# Altium schematic sheet Buck_Converter.SchDoc
size A; SheetNumber: 5; SheetTotal: 5
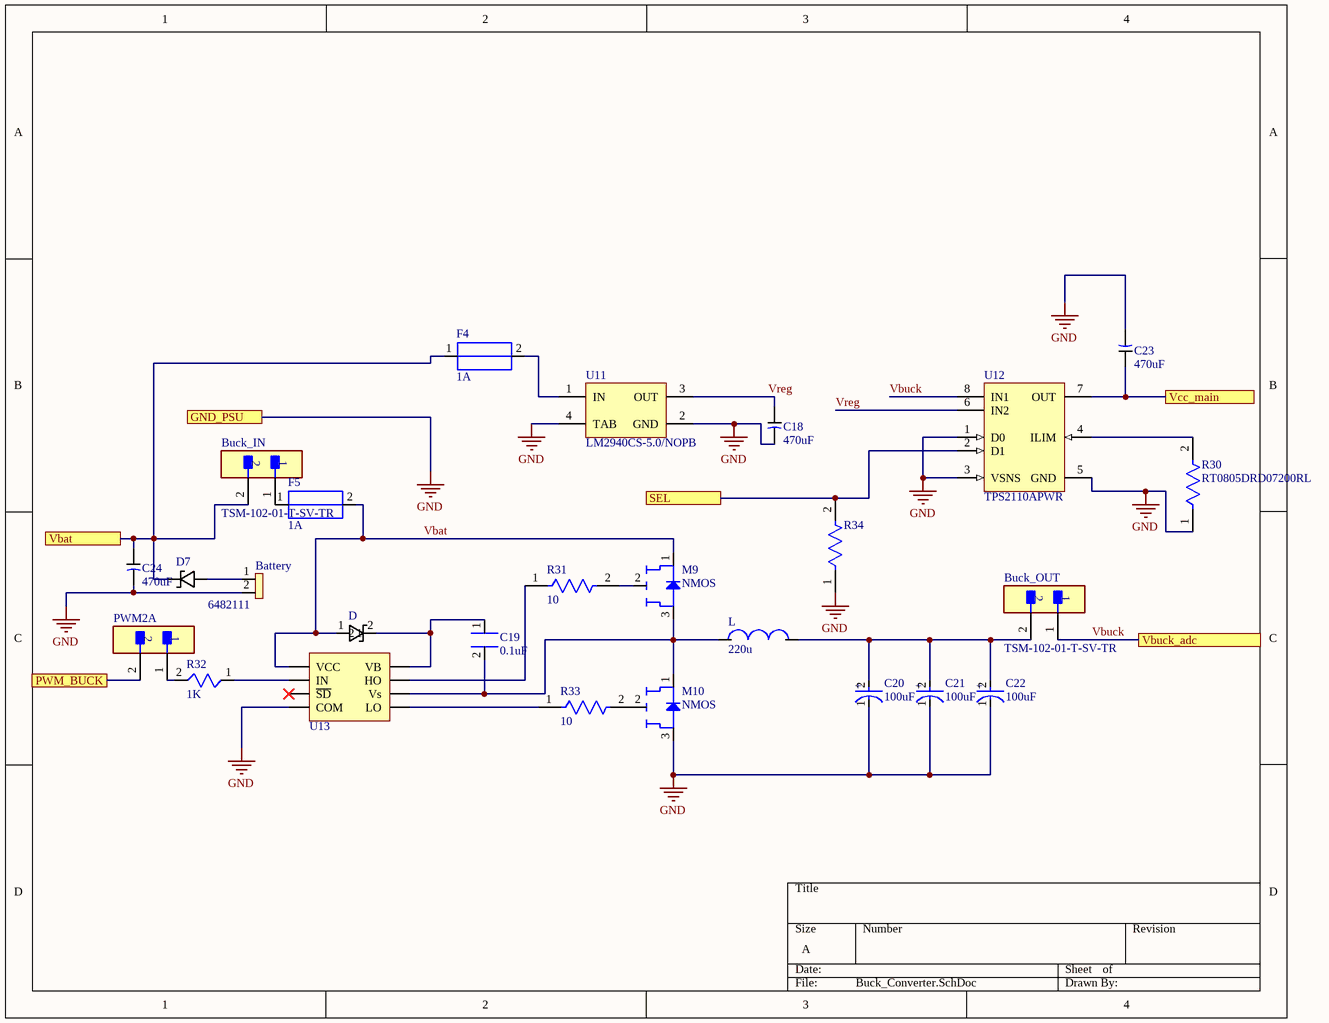
[diagram p0: Buck_Converter.SchDoc]

## Parts
Battery  Supplier Part Number 1: 6482111  [ERM BLOCK 2POS 45DEG 2.5MM PCB]  (hidden comment: Screw Terminal)
Buck_IN  TSM-102-01-T-SV-TR  [FP-TSM-102-01-T-SV-TR-MFG]
Buck_OUT  TSM-102-01-T-SV-TR  [FP-TSM-102-01-T-SV-TR-MFG]
C18  470uF  [ULR477M1AE85RR]
C19  0.1uF  [0805B104K500BD]
C20  100uF  [FP-TAJD-MFG]
C21  100uF  [FP-TAJD-MFG]
C22  100uF  [FP-TAJD-MFG]
C23  470uF  [ULR477M1AE85RR]
C24  470uF  [ULR477M1AE85RR]
D  BAS3005B02VH6327XTSA1  [BAS3005B02VH6327XTSA1]  (value not drawn)
D7  STPS2L25  [STPS2L25]  (value not drawn)
F4  1A  [0ZCG0050AF2C]
F5  1A  [0ZCG0050AF2C]
L  220u  [SRR1280-221K]
M9  NMOS  [AOD424]
M10  NMOS  [AOD424]
PWM2A  TSM-102-01-T-SV-TR  [FP-TSM-102-01-T-SV-TR-MFG]  (value not drawn)
R30  RT0805DRD07200RL  [FP-RT0805-MFG]
R31  10  [FP-RNCP1206-IPC_C]
R32  1K  [RNCP0805FTD10R0]
R33  10  [FP-RNCP1206-IPC_C]
R34  CRCW080510K0FKEA  [FP-CRCW0805-e3-IPC_A]  (value not drawn)
U11  LM2940CS-5.0/NOPB  [KTT0003B_N]
U12  TPS2110APWR  [PW0008A_N]
U13  IR2302  [IR2302S]  (value not drawn)

## Ports
GND_PSU, PWM_BUCK, SEL, Vbat, Vbuck_adc, Vcc_main

## Nets
GND: Battery.2 C18.1 C20.1(C) C21.1(C) C22.1(C) C23.1 C24.1 M10.3(S) R30.1 R34.1 U11.2(GND) U11.4(TAB) U12.1(D0) U12.3(VSNS) U12.5(GND) U13.4(COM) ; port GND_PSU
PWM_BUCK: PWM2A.2 ; port PWM_BUCK
SEL: R34.2 U12.2(D1) ; port SEL
Vbat: D.1 F5.2(-) M9.1(D) U13.1(VCC)
Vbat: Buck_IN.2 C24.2 D7.1 F4.1(+) ; port Vbat  [a separate net that carries the same name]
Vbuck: Buck_OUT.1 U12.8(IN1) ; port Vbuck_adc
Vcc_main: C23.2 U12.7(OUT) ; port Vcc_main
Vreg: C18.2 U11.3(OUT) U12.6(IN2)
NetBattery_1: Battery.1 D7.2
NetBuck_IN_1: Buck_IN.1 F5.1(+)
NetBuck_OUT_2: Buck_OUT.2 C20.2(A) C21.2(A) C22.2(A) L.2
NetC19_1: C19.1(+) D.2 U13.8(VB)
NetC19_2: C19.2 L.1 M9.3(S) M10.1(D) U13.6(Vs)
NetF4_2: F4.2(-) U11.1(IN)
NetM9_2: M9.2(G) R31.2
NetM10_2: M10.2(G) R33.2
NetPWM2A_1: PWM2A.1 R32.2(-)
NetR30_2: R30.2 U12.4(ILIM)
NetR31_1: R31.1 U13.7(HO)
NetR32_1: R32.1(+) U13.2(IN)
NetR33_1: R33.1 U13.5(LO)

Not connected (* = marked no-connect by the designer): U13 3(~{SD})*

## Notes on the sheet
- (in symbol CMP-2000-05064-2) +

## Library data of the parts
Battery = ERM BLOCK 2POS 45DEG 2.5MM PCB: Supplier 1: RSComponents
Buck_IN Buck_OUT PWM2A = CMP-02766-000113-1: CONN HEADER SMD 2POS 2.54MM; Gender: Male; Max Voltage Rating (AC): 475V; Number of Contacts: 2; Max Current Rating: 7A; Contact Material: Bronze; Min Operating Temperature: -55°C; REACH SVHC: No SVHC; Housing Material: Polymer; Lead Free: Lead Free; Orientation: Straight; Radiation Hardening: No; Number of Rows: 1; Length: 5.08mm; Housing Color: Black; Max Operating Temperature: 105°C; Contact Plating: Tin; Depth: 2.54mm; Packaging: Tape and Reel; Pitch: 2.54mm; Termination: Solder
C18 C23 C24 = ULR477M1AE85RR
C19 = 0805B104K500BD: 0.1 uF 50V Cap
C20-C22 = CMP-2000-05064-2: 100uF 16V  ±10% 600mΩ 2917  SMD Tantalum CapacitorTAJD107K016RNJ; Dissipation Factor: 6%; Polarity: Polar; Leakage Current: 16uA; ESR (Equivalent Series Resistance): 600mR; Depth: 4.3mm; Series: TAJ; Case Code (Metric): 7343; Min Operating Temperature: -55°C; Packaging: Tape and Reel; Termination: SMD/SMT; Voltage Rating (DC): 16V; Case/Package: 2917; Number of Pins: 2; Width: 4.3mm; Mount: Surface Mount; Tolerance: 10%; Voltage: 16V; Radiation Hardening: No; Lead Free: Lead Free; Capacitance: 100uF; Height: 2.9mm; RoHS Compliant: Yes; Max Operating Temperature: 125°C; Construction: Flat; Height - Seated (Max): 0.122inch; Case Code (Imperial): 2917; Package Quantity: 1; Dielectric Material: Tantalum; REACH SVHC: No SVHC; Features: General Purpose; Voltage Rating: 16V; Length: 7.3mm
D = BAS3005B02VH6327XTSA1: 30V, Vf 620 mV @ 500 mA, 25 µA @ 30 V, Fast Recovery =< 500ns, > 200mA
F4 F5 = 0ZCG0050AF2C: PTC Resettable Fuse 0.5A(hold) 1A(trip) 30VDC 100A 0.8W 0.15s 0.15Ohm SMD Solder Pad 1812 T/R; Manufacturer: Bel; Hold Current: 500mA; Supplier 1: Newark; Manufacturer Part Number: 0ZCG0050AF2C; RoHS: Yes; Category: PTC Resettable Fuses; Stock 1: 19101; Pricing 1: 1=0.14000, 10=0.12900, 25=0.12200, 50=0.11500, 100=0.10700, 250=0.09600 (USD); Mount: Surface Mount; Case/Package: 1812; Case Code (Metric): 4532; Case Code (Imperial): 1812; Contact Plating: Tin,Matte; Min Operating Temperature: -40°C; Max Operating Temperature: 85°C; Package Quantity: 1; Packaging: Tape and Reel; Max Current Rating: 100A; Trip Current: 1A; Time to Trip: 0.15s; Lead Free: Lead Free; RoHS Compliant: Yes; ComponentLink1URL: https://datasheet.ciiva.com/18550/0zcg-18550748.pdf?src-supplier=Digi-Key; ComponentLink1Description: https://datasheet.ciiva.com/18550/0zcg-18550748.pdf?src-supplier=Digi-Key; ComponentLink2URL: https://datasheet.ciiva.com/18550/0zcg-18550749.pdf?src-supplier=Digi-Key; ComponentLink2Description: https://datasheet.ciiva.com/18550/0zcg-18550749.pdf?src-supplier=Digi-Key; ComponentLink3URL: https://datasheet.ciiva.com/18550/0zcg-18550750.pdf?src-supplier=Digi-Key; ComponentLink3Description: https://datasheet.ciiva.com/18550/0zcg-18550750.pdf?src-supplier=Digi-Key; Supplier Part Number 1: 48AC8390
L = SRR1280-221K
M9 M10 = AOD424: MOSFET N-CH 20V 18A TO252; Manufacturer: Alpha & Omega Semiconductor; Rds On Max: 4.4mR; Input Capacitance: 4.63nF; Continuous Drain Current (ID): 45A; Max Power Dissipation: 2.5W; Number of Outputs: 2; Rise Time: 220ns; Output Current: 200mA; Min Supply Voltage: 5V; Nominal Supply Current: 1.6mA; Output Voltage: 620V; Propagation Delay: 950ns; Max Output Current: 350mA; Fall Time: 80ns; Turn-Off Delay Time: 70ns; Power Dissipation: 625mW; Min Output Voltage: 10V; Supplier 1: Digi-Key; Manufacturer Part Number: AOD424; RoHS: Yes; Category: Transistors; Stock 1: 1803; Pricing 1: 1=0.98000, 10=0.86400, 100=0.66240, 500=0.52360, 1000=0.41888 (USD); Mount: Surface Mount; Case/Package: TO-252-3; Min Operating Temperature: -55°C; Max Operating Temperature: 175°C; Packaging: Tape and Reel; Drain to Source Voltage (Vdss): 20V; Series: -; RoHS Compliant: Yes; ComponentLink1URL: https://datasheet.ciiva.com/6384/aod424-6384722.pdf?src-supplier=Digi-Key; ComponentLink1Description: https://datasheet.ciiva.com/6384/aod424-6384722.pdf?src-supplier=Digi-Key; ComponentLink2URL: https://datasheet.ciiva.com/6384/aod424-6384725.pdf?src-supplier=Digi-Key; ComponentLink2Description: https://datasheet.ciiva.com/6384/aod424-6384725.pdf?src-supplier=Digi-Key; Supplier 2: Newark; Number of Pins: 8; Package Quantity: 950; Max Supply Voltage: 20V; Number of Drivers: 2; Turn-On Delay Time: 70ns; Max Supply Current: 1.6mA; Max Output Voltage: 20V; Termination: SMD/SMT; Length: 5mm; Width: 4mm; Height: 1.5mm; Radiation Hardening: No; Lead Free: Lead Free; REACH SVHC: No SVHC; ComponentLink3URL: https://datasheet.ciiva.com/1952/ir2302-1952914.pdf?src-supplier=Digi-Key; ComponentLink3Description: https://datasheet.ciiva.com/1952/ir2302-1952914.pdf?src-supplier=Digi-Key; ComponentLink4URL: https://datasheet.ciiva.com/15110/getdatasheetpartid-188955-15110020.pdf?src-supplier=Verical; ComponentLink4Description: https://datasheet.ciiva.com/15110/getdatasheetpartid-188955-15110020.pdf?src-supplier=Verical; ComponentLink5URL: https://datasheet.ciiva.com/1499/60025-1499718.pdf?src-supplier=Element14; ComponentLink5Description: https://datasheet.ciiva.com/1499/60025-1499718.pdf?src-supplier=Element14; Supplier Part Number 1: 785-1565-1-ND
R30 = CMP-03412-013530-1: RES SMD 200 OHM 0.5% 1/8W 0805; Manufacturer: Yageo; Power Rating: 0.125W; Temperature Coefficient: 25 ppm/°C; Voltage Rating: 150V; Resistance: 200Ω; Tolerance: 0.01; Value: 200Ω; Manufacturer Part Number: RT0805DRD07200RL; Automotive: No; Temperature Range High: +155°C; Temperature: -55°C to +155°C; Device Class L3: Chip SMD Resistors; Composition: Thin Film; Lead Free: Yes; Package: RT0805; Temperature Range Low: -55°C; Height: 0.6mm; Category: Res; ComponentLink2URL: http://www.yageo.com/documents/recent/PYu-RT_1-to-0.01_RoHS_L_9.pdf; Device Class L2: Resistors; Series: RT; Footprint Url: http://www.yageo.com/exep/pages/download/literatures/PYu-R_Mount_10.pdf; Digikey Description: RES SMD 200 OHM 0.5% 1/8W 0805; RoHS: TRUE; Octopart: https://octopart.com/rt0805drd07200rl-yageo-1186132; ComponentLink2Description: Datasheet; Device Class L1: Passive Components; Ipc Land Pattern Name: RESC200125X50
R31 R33 = CMP-26527-002555-1: 10Ω ±1% 0.5W 1206 High Power Anti-Sulfur Thin Film Chip Resistor / RNCP1206FTD10R0; Resistance: 10R; Max Power Dissipation: 500mW; Temperature Coefficient: 100ppm/°C; Width: 0.059inch; Lead Free: Lead Free; Packaging: Tape and Reel; Height: 0.024inch; Min Operating Temperature: -55°C; Length: 0.122inch; Mount: Surface Mount; Max Operating Temperature: 155°C; Case Code (Metric): 3216; Case Code (Imperial): 1206; Series: RNCP; RoHS Compliant: Yes; Contact Plating: Tin; Case/Package: 1206; Tolerance: 1%; Features: Moisture Resistant; Number of Terminations: 2; Resistor Type: Thin Film
R32 = RNCP0805FTD1K00: Res Thin Film 0805 1K Ohm 1% 0.25W(1/4W) ±100ppm/C Sulfur Resistant Pad SMD T/R; Manufacturer: Stackpole Electronics; Resistance: 1kR; Power Rating: 250mW; Temperature Coefficient: 100ppm/°C; Supplier 1: Digi-Key; Manufacturer Part Number: RNCP0805FTD1K00; RoHS: Yes; Category: Chip SMD Resistors; Stock 1: 41120; Pricing 1: 1=0.10000, 10=0.07300, 100=0.02970, 1000=0.01336, 2500=0.01159 (USD); Mount: Surface Mount; Case/Package: 0805; Case Code (Metric): 2012; Case Code (Imperial): 0805; Size Code: 0805; Min Operating Temperature: -55°C; Max Operating Temperature: 155°C; Tolerance: 1%; Packaging: Tape and Reel; Resistor Type: Thin Film; Number of Terminations: 2; Max Power Dissipation: 250mW; Features: Moisture Resistant,Anti-Sulfur; Series: RNCP; Length: 0.079inch; Width: 0.049inch; Height: 0.024inch; Lead Free: Lead Free; RoHS Compliant: Yes; ComponentLink1URL: http://www.seielect.com/Catalog/SEI-rncp.pdf?src-supplier=Future+Electronics; ComponentLink1Description: http://www.seielect.com/Catalog/SEI-rncp.pdf?src-supplier=Future+Electronics; ComponentLink2URL: https://www.seielect.com/Catalog/SEI-rncp.pdf?src-supplier=Digi-Key; ComponentLink2Description: https://www.seielect.com/Catalog/SEI-rncp.pdf?src-supplier=Digi-Key; ComponentLink3URL: https://www.seielect.com/catalog/SEI-Packaging.pdf?src-supplier=Digi-Key; ComponentLink3Description: https://www.seielect.com/catalog/SEI-Packaging.pdf?src-supplier=Digi-Key; Supplier Part Number 1: RNCP0805FTD1K00CT-ND
R34 = CMP-2001-04908-2: RES Thick Film, 10kΩ, 1%, 0.125W, 100ppm/°C, 0805; Resistance: 10kR; Voltage Rating (DC): 150V; Power Rating: 125mW; Weight: 0.000194oz; Package Quantity: 5000; Military Standard: Not; Max Operating Temperature: 155°C; Temperature Coefficient: 100ppm/°C; Contact Plating: Tin; Width: 1.25mm; Height: 0.45mm; Radiation Hardening: No; Tolerance: 1%; Min Operating Temperature: -55°C; Voltage Rating: 150V; Length: 2mm; Depth: 1.25mm; Termination: SMD/SMT; Packaging: Tape and Reel; Case/Package: 0805; Case Code (Metric): 2012; Lead Free: Lead Free; Case Code (Imperial): 0805; Composition: Thick Film
U11 = CMP-0062-00606-4: 1A Low Dropout Regulator, 3-pin TO-263, Pb-Free; Manufacturer: Texas Instruments; PackageTopMarking: NSUZXYTTE#*LM2940CS*-5.0 P+; PowerWise: N; CompType: LDO IC; RoHS: Y; ComponentLink1URL: http://www.ti.com/general/docs/lit/getliterature.tsp?genericPartNumber=LM2940C&fileType=pdf; PinCount: 3; PackageReference: KTT0003B; ComponentLink1Description: Datasheet URL; PackageDescription: TO-263, Molded, .400 x .390 x .180in, 3 Lead, .1in Pitch, Surface Mount; Code_JEDEC: MO-169-AA
U12 = CMP-0339-00059-2: Dual In / Single Out Autoswitching Power Mux, 2.8 to 5.5 V, -40 to 85 degC, 8-pin TSSOP (PW), Green (RoHS & no Sb/Br); Manufacturer: Texas Instruments; SubFamily: Power Multiplexer (MUX); Number of Inputs: 2; IN2 Output Current(Max)(A): 0.75; IN1 rDS(on)(Typ)(mOhm): 120; IN1, IN2 Input Voltage(Max)(V): 5.5; IN2 rDS(on)(Typ)(Ohms): 0.12; IN1, IN2 Input Voltage(Min)(V): 2.8; PackageReference: PW0008A; ComponentLink1URL: http://www.ti.com/general/docs/lit/getliterature.tsp?genericPartNumber=TPS2110A&fileType=pdf; ComponentLink1Description: Datasheet; PackageDescription: 8-Pin Plastic Thin Small Outline Package 3 x 4.4 mm Body ,0.65 mm Pitch; Eco-Plan: Green (RoHS & no Sb/Br); PartNumber: TPS2110APWR; PackageVersion: revG, Feb-2011; Code_JEDEC: MO-153; IN1 Output Current(Max)(A): 0.75; Mounting Technology: Surface Mount; DatasheetVersion: SBVS043A
U13 = IR2302: Manufacture Part Number: IR2302